# Altium schematic sheet adapter-core.SchDoc
size A; SheetNumber: 1; SheetTotal: 2
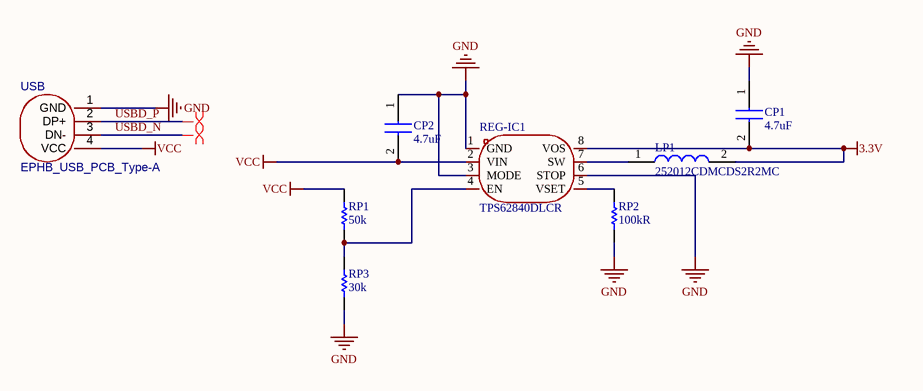
[diagram p0: adapter-core.SchDoc]

## Parts
CP1  4.7uF  [CAPC1608X87N]
CP2  4.7uF  [CAPC1608X87N]
LP1  252012CDMCDS2R2MC  [INDPM2520X120N]
REG-IC1  TPS62840DLCR  [VSON-8_L2.0-W1.5-P0.50-BL]
RP1  50k  [RESC1005X40X25LL05T05]
RP2  100kR  [RESC1005X40X25LL05T05]
RP3  30k  [RESC1005X40X25LL05T05]
USB  EPHB_USB_PCB_Type-A  [USB_PCB_Type-A]

## Nets
3.3V: CP1.2 LP1.2 REG-IC1.8(VOS)
GND: CP1.1 CP2.1 REG-IC1.1(GND) REG-IC1.3(MODE) REG-IC1.6(STOP) RP2.1 RP3.1 USB.1(GND)
VCC: CP2.2 REG-IC1.2(VIN) RP1.1 USB.4(VCC)
USBD_N: USB.3(DN-)
USBD_P: USB.2(DP+)
NetLP1_1: LP1.1 REG-IC1.7(SW)
NetREG-IC1_4: REG-IC1.4(EN) RP1.2 RP3.2
NetREG-IC1_5: REG-IC1.5(VSET) RP2.2

## Layout directives
differential pair: USBD_N, USBD_P

## Library data of the parts
CP1 CP2 = C0603C100D5GACTU: Capacitor; Manufacturer_Name: KEMET; Datasheet Link: https://content.kemet.com/datasheets/KEM_C1003_C0G_SMD.pdf; Height: 0.87mm; Manufacturer_Part_Number: C0603C100D5GACTU; Arrow Part Number: C0603C100D5GACTU; Arrow Price/Stock: https://www.arrow.com/en/products/c0603c100d5gactu/kemet-corporation
LP1 = 252012CDMCDS2R2MC: Inductor; Manufacturer_Name: Sumida; Manufacturer_Part_Number: 252012CDMCDS‐2R2MC; Datasheet Link: https://products.sumida.com/products/pdf/252012CDMCDDS%20(en).pdf; Height: 1.2mm
REG-IC1 = TPS62840DLCR: Manufacturer: TI(德州仪器); Add into BOM: yes; Function: 降压型; Output Type: 可调; Voltage - Supply: 1.8V~6.5V; Output Voltage: 1.8V~3.3V; Output Current: 750mA; Frequency - Switching: 1.8MHz; Synchronous Rectifier: 是; Number of Outputs: 1; Topology: 降压式; Switch tube (built-in/external): 内置; Symbol: TPS62840DLCR; Device: TPS62840DLCR; LCSC Part Name: 1.8V至6.5V、750mA、60nA IQ降压转换器; Supplier Part: C2071859; Manufacturer Part: TPS62840DLCR; Supplier Footprint: VSON-8(1.5x2); JLCPCB Part Class: Extended Part; Datasheet: https://www.ti.com/cn/lit/gpn/tps62840; Supplier: LCSC; Convert to PCB: yes; Operating Temperature: -40℃~+125℃@(TJ); Quiescent Current: -
RP1-RP3 = CMP-2002-01154-4: Chip Resistor, 4.7 KOhm, +/- 1%, 0.1 W, -55 to 155 degC, 0402 (1005 Metric), RoHS, Tape and Reel; PartNumber: ERJ-2RKF4701X; Voltage Rating: 50 V; Case\/Package: 0402; Power Rating: 100 mW; Height: 0.35 mm; Mounting Technology: Surface Mount; REACH SVHC: Yes; Resistance: 4.7 KOhm; Max Operating Temperature: 155 degC; ComponentLink1Description: Manufacturer URL; ComponentLink2Description: Datasheet; Pins: 2; PackageReference: 0402; Tolerance: 1%; Case Code (Imperial): 0402; Length: 1 mm; PackageDescription: 2-Pin Surface Mount Device, Body 1 x 0.5 mm; RoHSCompliant: true; Package Quantity: 1; Radiation Hardening: No; DatasheetVersion: 04/2015; Width: 0.5 mm; Case Code (Metric): 1005; Mount: Surface Mount; ComponentLink1URL: http://www.panasonic.com/; Min Operating Temperature: -55 degC; Packaging: Cut Tape; ComponentLink2URL: http://industrial.panasonic.com/cdbs/www-data/pdf/RDA0000/AOA0000C86.pdf
USB = EPHB_USB_PCB_Type-A: 板载USB-Type-A连接器; ConvertToPcb: yes; Symbol: EPHB_USB_PCB_Type-A; Device: EPHB_USB_PCB_Type-A; AddInBom: yes; FootprintName: USB_PCB_Type-A